# Altium schematic sheet PCI_Express.SchDoc: Dahlia Carrier Board
size A3; Organization: Toradex AG; Address1: Ebenaustrasse 10; Address2: Horw; Address3: 6048; Address4: Switzerland; DocumentNumber: 8; Revision: V1.1; SheetNumber: 8; SheetTotal: 21; PageSetup: Record=PageOptions|CenterHorizontal=True|CenterVertical=True|PrintScale=0.71|XCorrection=1.00|YCorrection=1.00|PrintKind=1|BorderSize=5000000|LeftOffset=0|BottomOffset=0|Orientation=2|PaperLength=1000|PaperWidth=1000|Scale=100|PaperSource=15|PrintQuality=600|MediaType=1|DitherType=10|PaperKind=A4|PrintScaleMode=1
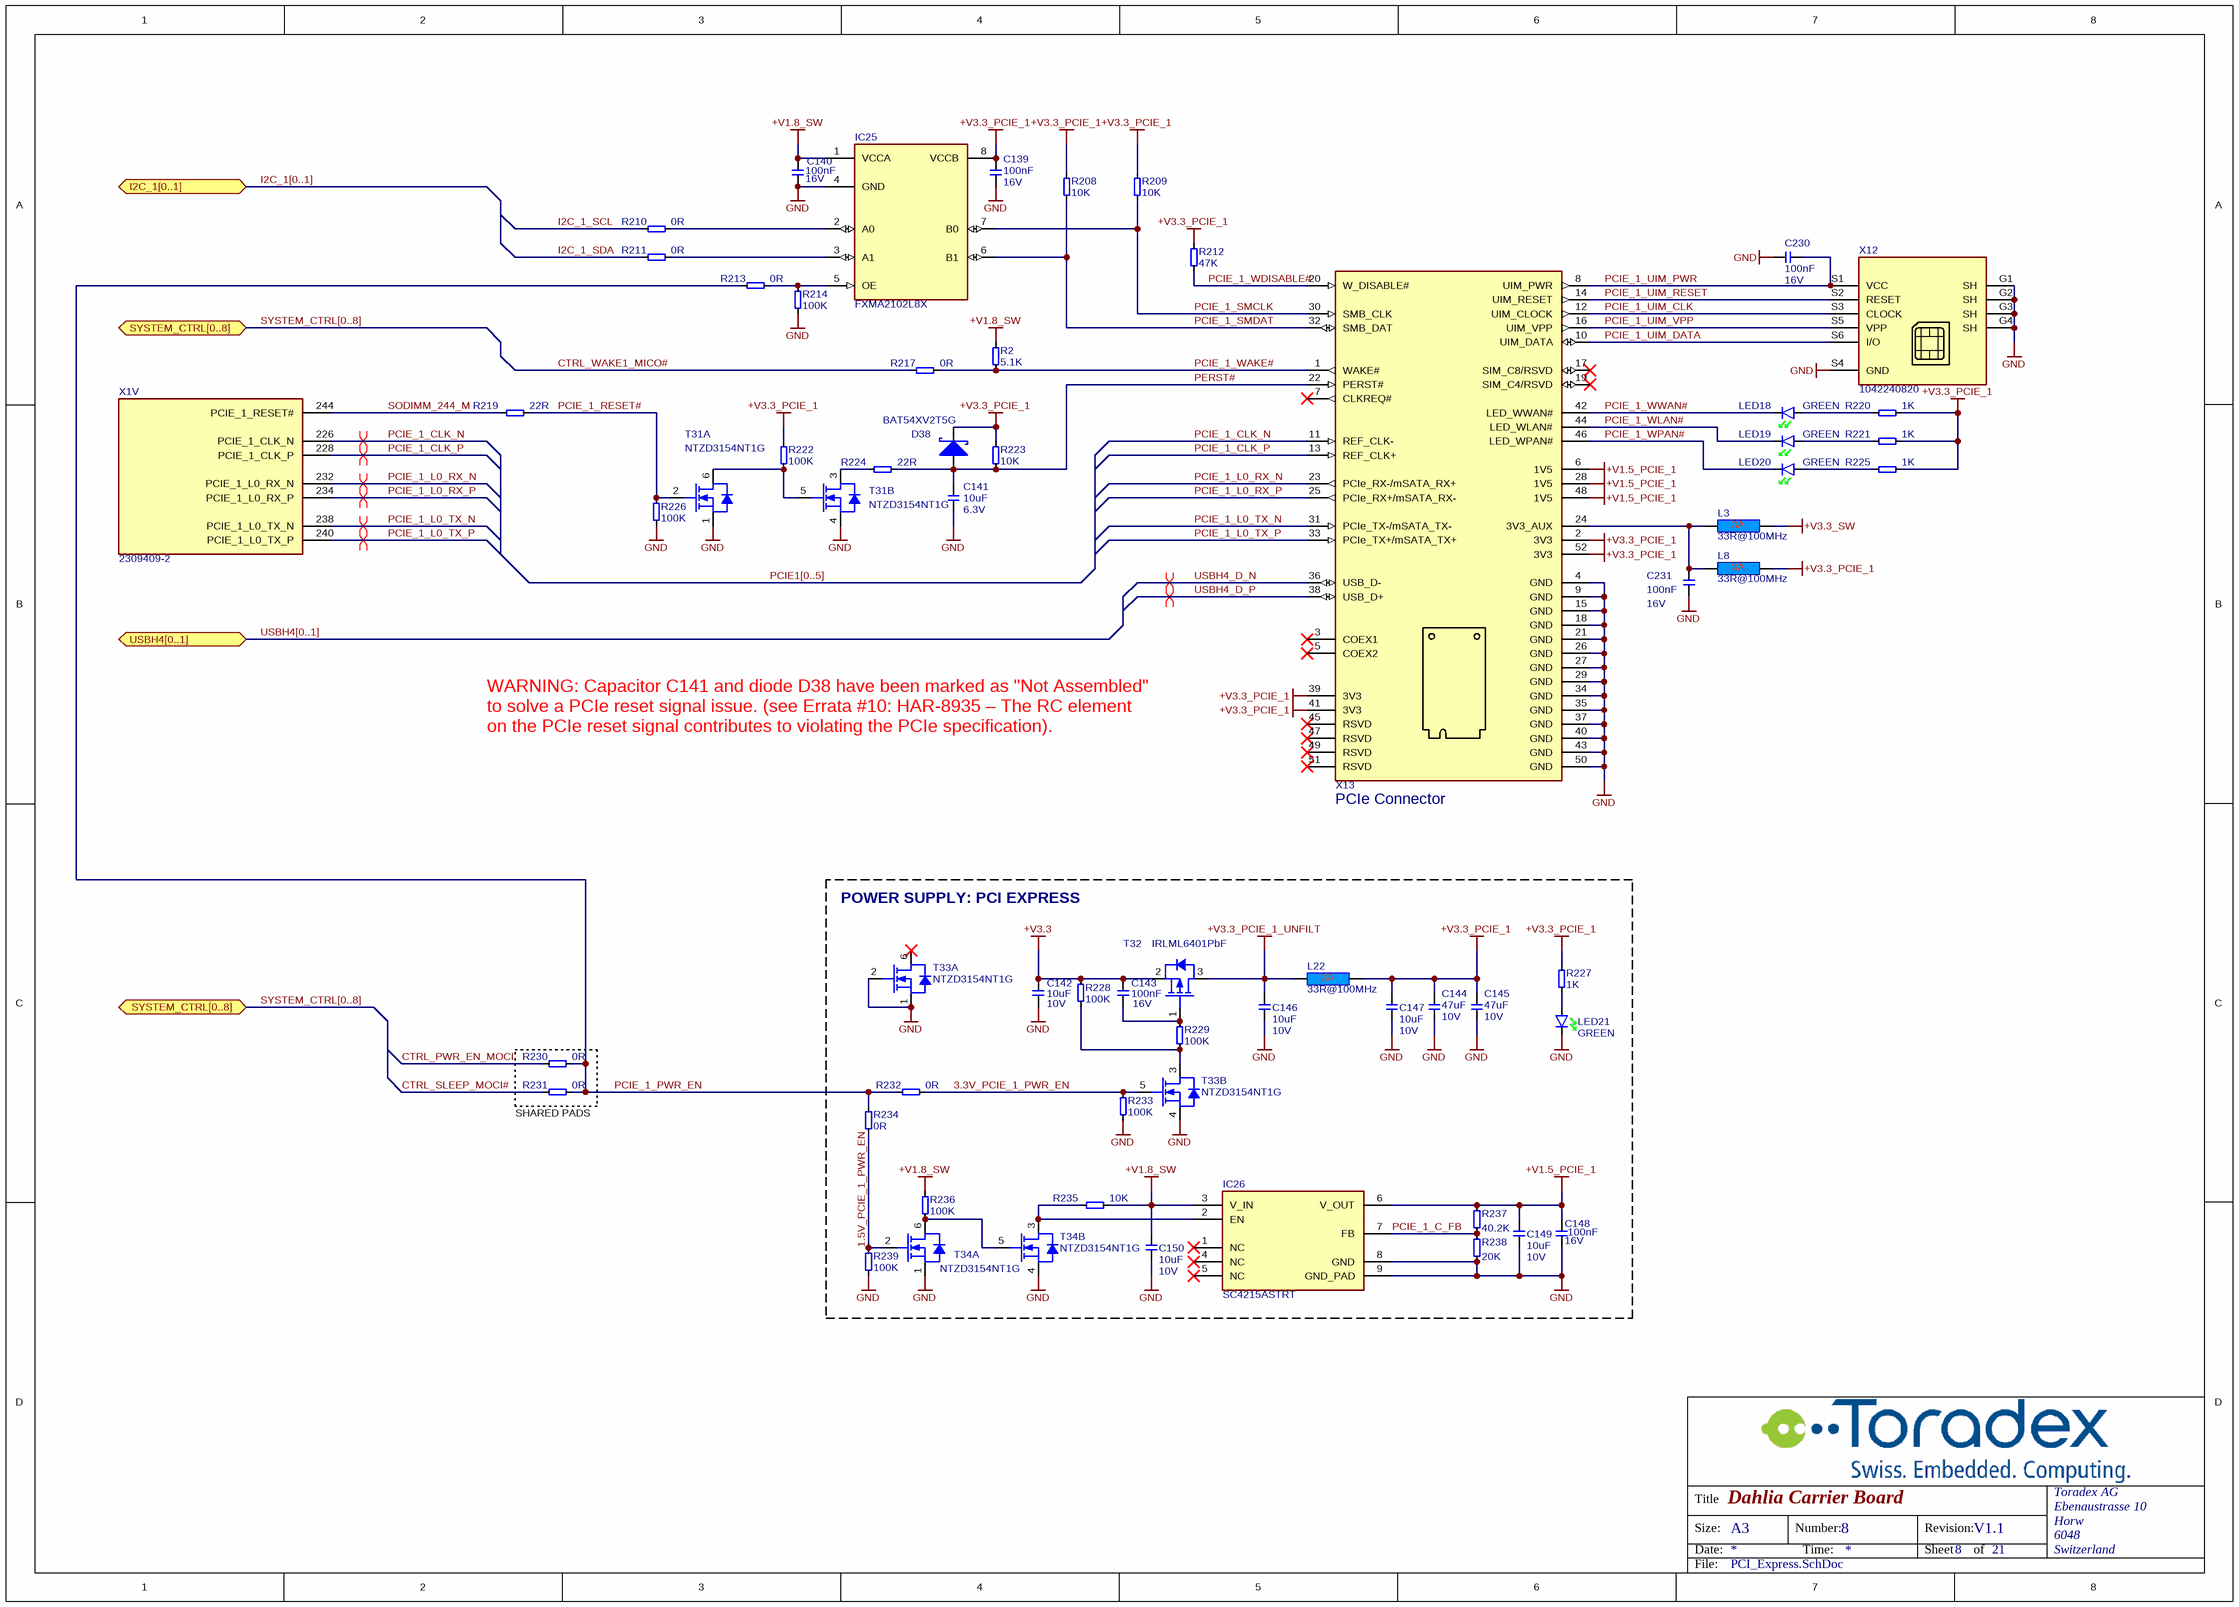
[diagram p0: PCI_Express.SchDoc]

## Parts
C139  Rating: 16V  [CAPC1005X60N]  (hidden comment: 100nF)
C140  Rating: 16V  [CAPC1005X60N]  (hidden comment: 100nF)
C141  Rating: 6.3V  [CAPC1005X60N]  (hidden comment: 10uF)
C142  Rating: 10V  [T_CAPC0603X33N]  (hidden comment: 10uF)
C143  Rating: 16V  [CAPC1005X60N]  (hidden comment: 100nF)
C144  Rating: 10V  [T_CAPC0805X125N]  (hidden comment: 47uF)
C145  Rating: 10V  [T_CAPC0805X125N]  (hidden comment: 47uF)
C146  Rating: 10V  [T_CAPC0603X33N]  (hidden comment: 10uF)
C147  Rating: 10V  [T_CAPC0603X33N]  (hidden comment: 10uF)
C148  Rating: 16V  [CAPC1005X60N]  (hidden comment: 100nF)
C149  Rating: 10V  [T_CAPC0603X33N]  (hidden comment: 10uF)
C150  Rating: 10V  [T_CAPC0603X33N]  (hidden comment: 10uF)
C230  Rating: 16V  [CAPC1005X60N]  (hidden comment: 100nF)
C231  Rating: 16V  [CAPC1005X60N]  (hidden comment: 100nF)
D38  BAT54XV2T5G  [SOD-523]
IC25  FXMA2102L8X  [IC-MicroPak50P160X2160X55-8N]
IC26  Manufacturer Part No.: SC4215ASTRT  [IC-SOIC127P650X175_HS-8N]  (hidden comment: IC-Semtech-SC4215A)
L3  33R@100MHz  [INDC1608X95N]
L8  33R@100MHz  [INDC1608X95N]
L22  33R@100MHz  [INDC1608X95N]
LED18  Color: GREEN  [T_Liteon_LTST-C190GKT]  (hidden comment: LTST-C190GKT)
LED19  Color: GREEN  [T_Liteon_LTST-C190GKT]  (hidden comment: LTST-C190GKT)
LED20  Color: GREEN  [T_Liteon_LTST-C190GKT]  (hidden comment: LTST-C190GKT)
LED21  Color: GREEN  [T_Liteon_LTST-C190GKT]  (hidden comment: LTST-C190GKT)
R2  5.1K  [T_RESC0603X30N]
R208  10K  [RESC1005X40N]
R209  10K  [RESC1005X40N]
R210  0R  [T_RESC0603X30N]
R211  0R  [T_RESC0603X30N]
R212  47K  [RESC1005X40N]
R213  0R  [T_RESC0603X30N]
R214  100K  [RESC1005X40N]
R217  0R  [T_RESC0603X30N]
R219  22R  [RESC1005X40N]
R220  1K  [RESC1005X40N]
R221  1K  [RESC1005X40N]
R222  100K  [RESC1005X40N]
R223  10K  [RESC1005X40N]
R224  22R  [RESC1005X40N]
R225  1K  [RESC1005X40N]
R226  100K  [RESC1005X40N]
R227  1K  [RESC1005X40N]
R228  100K  [RESC1005X40N]
R229  100K  [RESC1005X40N]
R230  0R  [T_RESC0603X30N]
R231  0R  [T_RESC0603X30N]
R232  0R  [T_RESC0603X30N]
R233  100K  [RESC1005X40N]
R234  0R  [T_RESC0603X30N]
R235  10K  [RESC1005X40N]
R236  100K  [RESC1005X40N]
R237  40.2K  [RESC1005X40N]
R238  20K  [RESC1005X40N]
R239  100K  [RESC1005X40N]
T31  Manufacturer Part No.: NTZD3154NT1G  [SOTFL50P160X60-6N]  (hidden comment: T-ONSemi-NTZD3154NT1G)  (parts A,B of 2)
T32  IRLML6401PbF  [SOT95P237X112-3N]
T33  Manufacturer Part No.: NTZD3154NT1G  [SOTFL50P160X60-6N]  (hidden comment: T-ONSemi-NTZD3154NT1G)  (parts A,B of 2)
T34  Manufacturer Part No.: NTZD3154NT1G  [SOTFL50P160X60-6N]  (hidden comment: T-ONSemi-NTZD3154NT1G)  (parts A,B of 2)
X1  2309409-2  [CON-TE-2309409-2-SOLDERABLE-STANDOFFS]  (part V of 23)
X12  1042240820  [T_Molex_1042240820]
X13  67910-5700  [CON-Molex-67910-5700-Half/Full]  (value not drawn)

## Blocks framed on the sheet
POWER SUPPLY: PCI EXPRESS: C142-C150 IC26 L22 LED21 R227-R229 R232-R239 T32-T34

## Ports
I2C_1[0..1] (bidir), SYSTEM_CTRL[0..8] (bidir), USBH4[0..1] (bidir)

## Nets
+V1.5_PCIE_1: C148.2 C149.2 IC26.6(V_OUT) R237.2 X13.6(1V5) X13.28(1V5) X13.48(1V5)
+V1.8_SW: C140.2 C150.2 IC25.1(VCCA) IC26.3(V_IN) R2.1 R235.1 R236.2
+V3.3: C142.2 C143.2 R228.2 T32.2(S)
+V3.3_PCIE_1: C139.2 C144.2 C145.2 C147.2 D38.C IC25.8(VCCB) L8.2 L22.2 R208.2 R209.2 R212.2 R220.1 R221.1 R222.2 R223.2 R225.1 R227.2 X13.2(3V3) X13.39(3V3) X13.41(3V3) X13.52(3V3)
+V3.3_PCIE_1_UNFILT: C146.2 L22.1 T32.3(D)
+V3.3_SW: L3.2
GND: C139.1 C140.1 C141.1 C142.1 C144.1 C145.1 C146.1 C147.1 C148.1 C149.1 C150.1 C230.1 C231.1 IC25.4(GND) IC26.8(GND) IC26.9(GND_PAD) LED21.K R214.1 R226.1 R233.1 R238.1 R239.1 T31.1(S) T31.4(S) T33.1(S) T33.2(G) T33.4(S) T34.1(S) T34.4(S) X12.G1(SH) X12.G2(SH) X12.G3(SH) X12.G4(SH) X12.S4(GND) X13.4(GND) X13.9(GND) X13.15(GND) X13.18(GND) X13.21(GND) X13.26(GND) X13.27(GND) X13.29(GND) X13.34(GND) X13.35(GND) X13.37(GND) X13.40(GND) X13.43(GND) X13.50(GND)
1.5V_PCIE_1_PWR_EN: R234.1 R239.2 T34.2(G)
3.3V_PCIE_1_PWR_EN: R232.2 R233.2 T33.5(G)
CTRL_PWR_EN_MOCI: R230.1
CTRL_SLEEP_MOCI#: R231.1
CTRL_WAKE1_MICO#: R217.1
I2C_1_SCL: R210.1
I2C_1_SDA: R211.1
PCIE_1_C_FB: IC26.7(FB) R237.1 R238.2
PCIE_1_CLK_N: X1.226(PCIE_1_CLK_N) X13.11(REF_CLK-)
PCIE_1_CLK_P: X1.228(PCIE_1_CLK_P) X13.13(REF_CLK+)
PCIE_1_L0_RX_N: X1.232(PCIE_1_L0_RX_N) X13.23(PCIe_RX-/mSATA_RX+)
PCIE_1_L0_RX_P: X1.234(PCIE_1_L0_RX_P) X13.25(PCIe_RX+/mSATA_RX-)
PCIE_1_L0_TX_N: X1.238(PCIE_1_L0_TX_N) X13.31(PCIe_TX-/mSATA_TX-)
PCIE_1_L0_TX_P: X1.240(PCIE_1_L0_TX_P) X13.33(PCIe_TX+/mSATA_TX+)
PCIE_1_PWR_EN: R213.1 R230.2 R231.2 R232.1 R234.2
PCIE_1_RESET#: R219.2 R226.2 T31.2(G)
PCIE_1_SMCLK: IC25.7(B0) R209.1 X13.30(SMB_CLK)
PCIE_1_SMDAT: IC25.6(B1) R208.1 X13.32(SMB_DAT)
PCIE_1_UIM_CLK: X12.S3(CLOCK) X13.12(UIM_CLOCK)
PCIE_1_UIM_DATA: X12.S6(I/O) X13.10(UIM_DATA)
PCIE_1_UIM_PWR: C230.2 X12.S1(VCC) X13.8(UIM_PWR)
PCIE_1_UIM_RESET: X12.S2(RESET) X13.14(UIM_RESET)
PCIE_1_UIM_VPP: X12.S5(VPP) X13.16(UIM_VPP)
PCIE_1_WAKE#: R2.2 R217.2 X13.1(WAKE#)
PCIE_1_WDISABLE#: R212.1 X13.20(W_DISABLE#)
PCIE_1_WLAN#: LED19.K X13.44(LED_WLAN#)
PCIE_1_WPAN#: LED20.K X13.46(LED_WPAN#)
PCIE_1_WWAN#: LED18.K X13.42(LED_WWAN#)
PERST#: C141.2 D38.A R223.1 R224.2 X13.22(PERST#)
SODIMM_244_M: R219.1 X1.244(PCIE_1_RESET#)
USBH4_D_N: X13.36(USB_D-)
USBH4_D_P: X13.38(USB_D+)
NetC143_1: C143.1 R229.2 T32.1(G)
NetC231_2: C231.2 L3.1 L8.1 X13.24(3V3_AUX)
NetIC25_2: IC25.2(A0) R210.2
NetIC25_3: IC25.3(A1) R211.2
NetIC25_5: IC25.5(OE) R213.2 R214.2
NetIC26_2: IC26.2(EN) R235.2 T34.3(D)
NetLED18_A: LED18.A R220.2
NetLED19_A: LED19.A R221.2
NetLED20_A: LED20.A R225.2
NetLED21_A: LED21.A R227.1
NetR222_1: R222.1 T31.5(G) T31.6(D)
NetR224_1: R224.1 T31.3(D)
NetR228_1: R228.1 R229.1 T33.3(D)
NetR236_1: R236.1 T34.5(G) T34.6(D)

Not connected (* = marked no-connect by the designer): IC26 1(NC)* 4(NC)* 5(NC)*; T33 6(D)*; X13 3(COEX1)* 5(COEX2)* 7(CLKREQ#)* 17(SIM_C8/RSVD)* 19(SIM_C4/RSVD)* 45(RSVD)* 47(RSVD)* 49(RSVD)* 51(RSVD)*

## Buses and harness runs
bus I2C_1[0..1] = port I2C_1[0..1]
bus PCIE1[0..5]
bus SYSTEM_CTRL[0..8] = port SYSTEM_CTRL[0..8]
bus USBH4[0..1] = port USBH4[0..1]

## Layout directives
differential pair; differential pair class PCIe: PCIE_1_CLK_N, PCIE_1_CLK_P, PCIE_1_L0_RX_N, PCIE_1_L0_RX_P, PCIE_1_L0_TX_N, PCIE_1_L0_TX_P
differential pair; differential pair class USB: USBH4_D_N, USBH4_D_P

## Notes on the sheet
- WARNING: Capacitor C141 and diode D38 have been marked as "Not Assembled" to solve a PCIe reset signal issue. (see Errata #10: HAR-8935 – The RC element on the PCIe reset signal contributes to violating the PCIe specification).
- (near X13) PCIe Connector
- (near R231) SHARED PADS
- Title
- Size:
- Date:
- A3
- Number:
- Time:
- Revision:
- Sheet
- of
- File:

## Library data of the parts
C139 C140 C143 C148 C230 C231 = C-X7R-100nF-16V-10%-0402: Capacitor Ceramic X7R 100nF 16V 10% 0402; Tolerance: 10%; Type: X7R; Value: 100nF
C141 = C-X5R-10u-6.3V-20%-0402: Capacitor Ceramic X5R 10uF 6.3V 20% 0402; Tolerance: 20%; Type: X5R; Value: 10uF
C142 C146 C147 C149 C150 = C-X5R-10uF-10V-20%-0603: Capacitor Ceramic X5R 10uF 10V 20% 0603; Tolerance: 20%; Type: X5R; Value: 10uF
C144 C145 = C-X5R-47uF-10V-20%-0805: Capacitor Ceramic X5R 47uF 10V 20% 0805; Tolerance: 20%; Type: X5R; Value: 47uF
D38 = D-BAT54-SOD523: Schottky Barrier Rectifier; Manufacturer Name: On Semi; Manufacturer Part No.: BAT54XV2T5G
IC25 = IC-ONsemi-FXMA2102L8X: Voltage Level Translator for I2C Applications; Manufacturer Name: ONSemi; Manufacturer Part No.: FXMA2102L8X
IC26 = IC-Semtech-SC4215A: LDO TO 2A; Manufacturer Name: Semtech; Package: *; Temperature Range: *
L3 L8 L22 = L-33R@100MHz-3A-25%-0603: 33R@100MHz 3A EMI FILTER; Tolerance: 25%; Rating: 3A; Value: 33R@100MHz
LED18-LED21 = LED-LiteOn-LTST-C190GKT: LED green Lite-ON LTST-C190GKT; Manufacturer Name: Lite-ON; Manufacturer Part No.: LTST-C190GKT
R2 = R-5.1K-63mW-1%-0603: Resistor 5.1 Kohm 63mW 1% 0603; Rating: 63mW; Tolerance: 1%; Value: 5.1K
R208 R209 R223 R235 = R-10K-63mW-5%-0402: Resistor 10 Kohm 63mW 5% 0402; Rating: 63mW; Tolerance: 5%; Value: 10K
R210 R211 R213 R217 R230-R232 R234 = R-0R-63mW-1%-0603: Resistor 0 ohm 63mW 1% 0603; Rating: 63mW; Tolerance: 1%; Value: 0R
R212 = R-47K-63mW-1%-0402: Resistor 47 Kohm 63mW 1% 0402; Rating: 63mW; Tolerance: 1%; Value: 47K
R214 R222 R226 R228 R229 R233 R236 R239 = R-100K-63mW-5%-0402: Resistor 100 Kohm 63mW 5% 0402; Rating: 63mW; Tolerance: 5%; Value: 100K
R219 R224 = R-22R-63mW-5%-0402: Resistor 22 ohm 63mW 5% 0402; Rating: 63mW; Tolerance: 5%; Value: 22R
R220 R221 R225 R227 = R-1K-63mW-5%-0402: Resistor 1 Kohm 63mW 5% 0402; Rating: 63mW; Tolerance: 5%; Value: 1K
R237 = R-40.2KR-63mW-1%-0402: Resistor 40.2 Kohm 63mW 1% 0402; Value: 40.2KR; Rating: 63mW; Tolerance: 1%
R238 = R-20KR-63mW-1%-0402: Resistor 20 Kohm 63mW 1% 0402; Value: 20KR; Rating: 63mW; Tolerance: 1%
T31 T33 T34 = T-ONSemi-NTZD3154NT1G: Dual N-Channel 20V (D-S)  MOSFET; Manufacturer Name: ONSemi
T32 = T-IR-IRLML6401PbF-SOT-23: p-channel MOSFET, IRLML6401PbF; Manufacturer Name: International Rectifier; Manufacturer Part No.: IRLML6401PbF
X1 = CON-TE-2309409-2: DDR4 SODIMM Socket, 260 pins, 5.2mm(H), 0.5mm Pitch; Manufacturer Name: TE; Temperature Range: -40C to +125C; Package: DDR4-SODIMM-260; Manufacturer Part No.: 2309409-2
X12 = CON-Molex-1042240820: 6 Contacts Nano Sim Card Holder; Manufacturer Name: Molex; Manufacturer Part No.: 1042240820
X13 = CON-Molex-67910-5700: PCIe_Mini Card Holder; Manufacturer Name: Molex; Manufacturer Part No.: 67910-5700